# EAGLE design working (EAGLE 9.6.2)
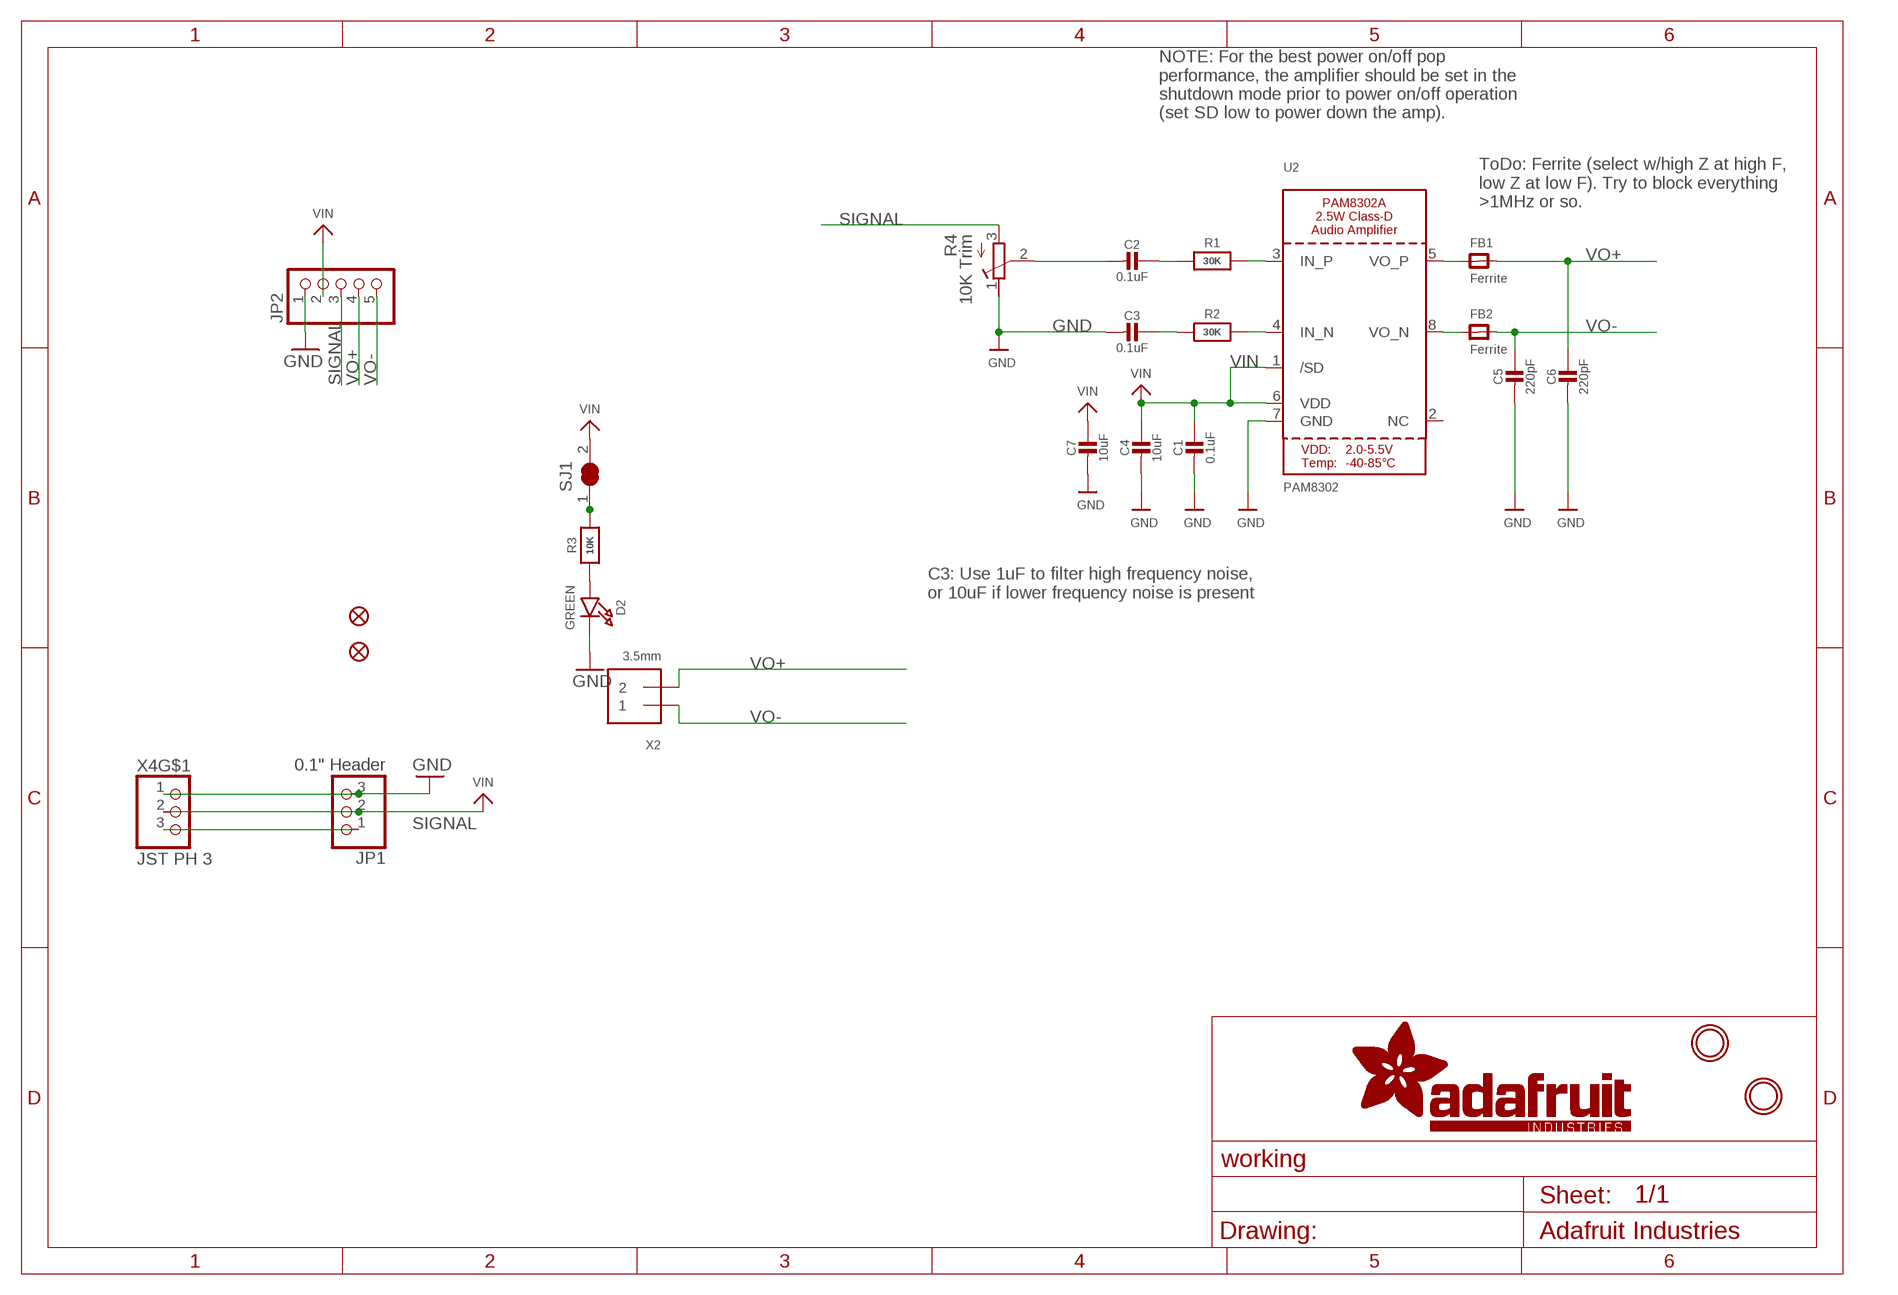
[diagram p0: schematic, sheet 1]

## Parts
C1  0.1uF  CAP_CERAMIC0603_NO  [0603-NO]
C2  0.1uF  CAP_CERAMIC0603_NO  [0603-NO]
C3  0.1uF  CAP_CERAMIC0603_NO  [0603-NO]
C4  10uF  CAP_CERAMIC0805-NOOUTLINE  [0805-NO]
C5  220pF  CAP_CERAMIC0603_NO  [0603-NO]
C6  220pF  CAP_CERAMIC0603_NO  [0603-NO]
C7  10uF  CAP_CERAMIC0805-NOOUTLINE  [0805-NO]
D2  GREEN  LED0603_NOOUTLINE  [CHIPLED_0603_NOOUTLINE]
FB1  Ferrite  FERRITE-0603NO  [0603-NO]
FB2  Ferrite  FERRITE-0603NO  [0603-NO]
FID2  FIDUCIAL_1MM  [FIDUCIAL_1MM]
FID3  FIDUCIAL_1MM  [FIDUCIAL_1MM]
JP1  0.1" Header  HEADER-1X3  [1X03_OVAL]
JP2  HEADER-1X570MIL  [1X05_ROUND_70]
R1  30K  RESISTOR_0603_NOOUT  [0603-NO]
R2  30K  RESISTOR_0603_NOOUT  [0603-NO]
R3  10K  RESISTOR_0603_NOOUT  [0603-NO]
R4  10K Trim  R-TRIMM3314J  [RTRIM3314J]
SJ1  SOLDERJUMPER_CLOSED  [SOLDERJUMPER_CLOSEDWIRE]
U2  PAM8302  AUDIOAMP_PAM8302A  [MSOP8_0.65MM]
U$1  MOUNTINGHOLE2.5  [MOUNTINGHOLE_2.5_PLATED]
U$8  MOUNTINGHOLE2.5  [MOUNTINGHOLE_2.5_PLATED]
X2  3.5mm  TERMBLOCK_1X2_3.5MM  [TERMBLOCK_1X2-3.5MM]
X4  JST PH 3  CON_JST_PH_3PIN  [JSTPH3]

## Nets
GND: C1.2 C3.2 C4.2 C5.2 C6.2 C7.2 D2.C JP1.3 JP2.1 R4.1(E) U2.7(GND) X4.1
IN+: R1.2 U2.3(IN_P)
IN-: R2.2 U2.4(IN_N)
N$1: R3.2 SJ1.1
N$5: C3.1 R2.1
N$8: C2.1 R1.1
N$9: C2.2 R4.2(S)
N$26: D2.A R3.1
OUT+: FB1.1 U2.5(VO_P)
OUT-: FB2.1 U2.8(VO_N)
SIGNAL: JP1.1 JP2.3 R4.3(A) X4.3
VIN: C1.1 C4.1 C7.1 JP1.2 JP2.2 SJ1.2 U2.1(/SD) U2.6(VDD) X4.2
VO+: C6.1 FB1.2 JP2.4 X2.2
VO-: C5.1 FB2.2 JP2.5 X2.1
Unconnected: U2.2(NC) X4.NC1(MT) X4.NC2(MT)

## Notes on the sheet
- NOTE: For the best power on/off pop
  performance, the amplifier should be set in the
  shutdown mode prior to power on/off operation
  (set SD low to power down the amp).
- ToDo: Ferrite (select w/high Z at high F,
  low Z at low F). Try to block everything
  >1MHz or so.
- C3: Use 1uF to filter high frequency noise,
  or 10uF if lower frequency noise is present

## Library data of the parts
C1-C7 = microbuilder:CAP_CERAMIC: Ceramic Capacitors For new designs, use the packages preceded by an '_' character since they are more reliable: The following footprints should be used on most boards: _0402 - Standard footprint for regular board layouts _0603 - Standard footprint for regular board layouts _0805 - Standard footprint for regular board layouts _1206 - Standard footprint for regular board layouts For extremely tight-pitch boards where space is at a premium, the following 'micro-pitch' footprints can be used (smaller pads, no silkscreen outline, etc.): _0402MP - Micro-pitch footprint for very dense/compact boards _0603MP - Micro-pitch footprint for very dense/compact boards _0805MP - Micro-pitch footprint for very dense/compact boards _1206MP - Micro-pitch footprint for very dense/compact boards
D2 = microbuilder:LED: LED 0603 - 0603 Surface Mount Package 2mA: Green LED - Low Power (3.9mcd, 2ma, 1.7Vf) - Digikey: 475-2709-2-ND Orange LED - Low Power (9.8mcd, 2ma, 1.8Vf) - Digikey: 475-1194-2-ND Red LED - Low Power (5mcd, 2ma, 1.8Vf) - Digikey: 475-1195-2-ND Yellow LED - Low Power (7mcd, 2ma, 1.8Vf) - Digikey: 475-1196-2-ND 5mA: Blue LED - Low Power (17mcd, 5ma, 2.9Vf) - Digikey: LNJ937W8CRACT-ND 0805 - 0805 Surface Mount Package 2mA: Red LED (8.8mcd, 2mA, 1.8Vf, Clear) - Low Power [Digikey: 475-2510-1-ND] Green LED (5mcd, 2mA, 1.8Vf, Clear) - Low Power [Digikey: 475-2730-1-ND] Yellow LED (11.3mcd, 2mA, 1.8Vf, Clear) - Low Power [Digikey: 475-2555-1-ND] 20mA: Red LED (104mcd, 20mA, Diffused) - LS R976 [Digikey: 475-1278-6-ND] Red LED (12mcd, 20mA, 2.0Vf, Clear) - APT2012EC [Digikey: 754-1128-1-ND] Green LED (15mcd, 20mA, 2.2Vf, Clear) - APT2012GC [Digikey: 754-1131-1-ND] Orange LED (160mcd, 20mA, 2.1Vf, Clear) - APT2012SECK [Digikey: 754-1130-1-ND] 1206 - 1206 Surface Mount Package Green LED (26mcd, 20mA, Diffused) - LG N971 [Digikey: 475-1407-6-ND] Red LED (15mcd, 20mA, Diffused) - LH N974 [Digikey: 475-1416-6-ND] Cree - Cree High-Power Surface Mount LEDs XPEBWT-L1-0000-00D50 - White 111lm 350mA 2.9Vf 6200K 110° XTEAWT-00-0000-00000LEE3 - White 114lm 350mA 2.85Vf 5000K 115° Everlight - Everlight 45-21 Series Surface Mount LEDs 45-21/QK2C-B2832AC2CB2/2T - Warm White 2000mcd 20mA 3.25Vf 3050K 120° 45-21/LK2C-B38452C4CB2/2T - Nuetral White 2000mcd 20mA 3.25Vf 4150K 120° 45-21/LK2C-B50634C6CB2/2T - Cold White 2200mcd 20mA 3.25Vf 5650K 120° PLCC2 Reverse Mount LS T77K-J1L2-1-0-2-R18-Z - Red 11.25mcd 2mA 1.8Vf 630nm 120° LO T77K-L1M2-24-Z - Orange 19.6mcd 2mA 1.8Vf 606nm 120° LY T77K-K2M1-26-Z - Yellow 15.7mcd 2mA 1.8Vf 587nm 120°; ROT: 270
FB1 FB2 = microbuilder:FERRITE: Ferrite Bead 0603 MMZ1608B121C - 120 Ohm @ 100MHz, 600mA, 0.15 Ohm DC Resistance - Digikey: 445-2164-1-ND BK1608HW121-T - 120 Ohm, 600mA Ferrite Chip - Digikey: 587-1876-2-ND 0805 HZ0805B272R-10 - 2.7K Ohm @ 100MHz, 200mA, 0.8 Ohm DC Resistance - Digikey: 240-2504-1-ND (see also Murata BLM21BD272SN1L) MMZ2012Y152B - 1.5K Ohm @ 100MHz, 500mA, 0.4 Ohm DC Resistance - Digikey: 445-1560-1-ND - Mainly for high frequency (80-400MHz) MMZ2012R102A - 1K Ohm @ 100MHz, 500mA, 0.3 Ohm DC Resistance - Digikey: 445-1555-2-ND - More general purpose (10-200MHz)
FID2 FID3 = microbuilder:FIDUCIAL: Fiducial Alignment Points Various fiducial points for machine vision alignment.; BOM: EXCLUDE
JP1 = microbuilder:HEADER-1X3: PIN HEADER
JP2 = microbuilder:HEADER-1X5: PIN HEADER
R1-R3 = microbuilder:RESISTOR: Resistors For new designs, use the packages preceded by an '_' character since they are more reliable: The following footprints should be used on most boards: _0402 - Standard footprint for regular board layouts _0603 - Standard footprint for regular board layouts _0805 - Standard footprint for regular board layouts _1206 - Standard footprint for regular board layouts For extremely tight-pitch boards where space is at a premium, the following 'micro-pitch' footprints can be used (smaller pads, no silkscreen outline, etc.): _0402MP - Micro-pitch footprint for very dense/compact boards _0603MP - Micro-pitch footprint for very dense/compact boards _0805MP - Micro-pitch footprint for very dense/compact boards _1206MP - Micro-pitch footprint for very dense/compact boards
R4 = adafruit_electromech:R-TRIMM: Trimm resistor; SPICEMODEL: X; SPICEPREFIXL: POT
SJ1 = microbuilder:SOLDERJUMPER_CLOSED: Solder Jumper - Closed These solder jumpers are closed by default CLOSEDWIRE - 10 mil trace between pads that can be cut and resoldered later CLOSEDPERM - 63 mil trace between pads for a permanent connection (used to 'bridge' two signals, a shameless hack for Eagle). Can double as a test point as well (no cream layer)
U2 = microbuilder:AUDIOAMP_PAM8302A: PAM8302A - 2.5W Class-D Mono Audio Amplifier MSOP8 = PAM8302AASCR
U$1 U$8 = adafruit_electromech:MOUNTINGHOLE: Mounting Hole For #2 screws (0.086"/2.18mm width, 0.094"/2.4mm hole) use 2.5mm; BOM: EXCLUDE
X2 = adafruit_electromech:TERMBLOCK_1X2: 3.5mm Terminal block http://www.ladyada.net/library/pcb/eaglelibrary.html; ROT: 180
X4 = adafruit_electromech:CON_JST_PH_3PIN

## Net classes
1 HV: width 0.406 mm, drill 0.381 mm, clearance 0.762 mm

## Board
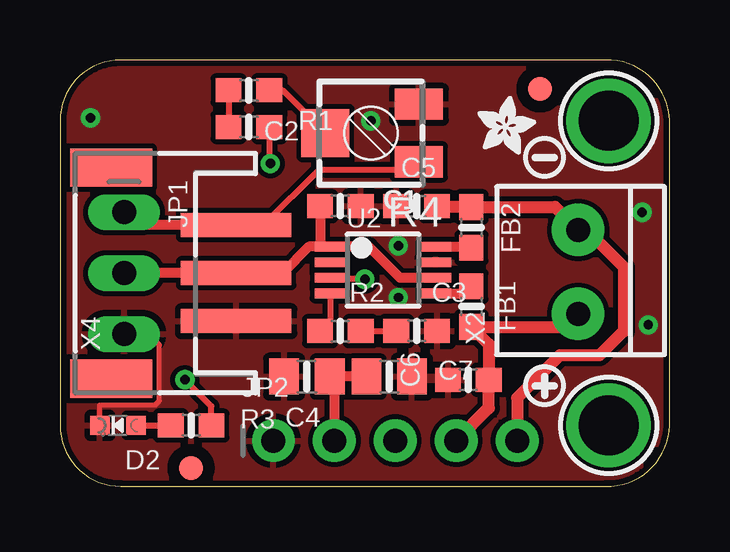
[diagram p1: board, top side]
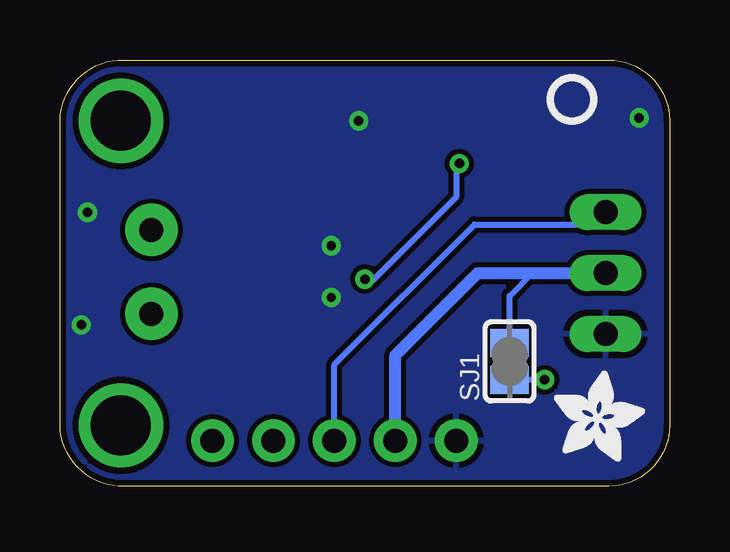
[diagram p2: board, bottom side, seen from below]

Size 25.4 x 17.78 mm. Coordinates in mm from the lower left corner, seen from the top.
Outline: 0,15.24 0,2.54 arc90 2.54,0 22.73,0 arc90 25.4,2.54 25.4,15.24 arc90 22.73,17.78 2.54,17.78 arc90 0,15.24
Copper layers (1*16): Top 0.035mm / dielectric 1.5mm / Bottom 0.035mm
Design rules "adafruit": minimum track width 8mil, minimum drill 15.5mil, track to track 8mil, track to pad 8mil, pad to pad 8mil, via to via 8mil, smd to smd 8mil, copper to edge 10mil, drill to drill 8mil, minimum pad ring 10mil, minimum via ring 8mil, stop-mask expansion 2mil, vias tented up to drill 20mil, thermal gap 10mil

### Footprints (pad centres in the part's own frame; a part is rotated, then mirrored left to right if it is on the bottom)
0603-NO = smd 1.075 x 1: 1 -0.85,0; 2 0.85,0
0805-NO = smd 1.24 x 1.5: 1 -0.95,0; 2 0.95,0
CHIPLED_0603_NOOUTLINE = smd 0.8 x 0.8: A 0,-0.75; C 0,0.75
FIDUCIAL_1MM = smd 1 x 1: 1 0,0
1X03_OVAL = drill 1 long: 1 -2.54,0; 2 0,0; 3 2.54,0
1X05_ROUND_70 = drill 1 pad 1.778: 1 -5.08,0; 2 -2.54,0; 3 0,0; 4 2.54,0; 5 5.08,0
RTRIM3314J = smd 1.3 x 2: 1 1.2,-2; 3 -1.2,-2 | smd 2 x 2: 2 0,1.9
SOLDERJUMPER_CLOSEDWIRE = smd 1.168 x 1.6: 1 -0.762,0; 2 0.762,0 | smd 0.635 x 0.203: WIRE 0,0
MSOP8_0.65MM = smd 0.4 x 1.3: 1 -0.975,-2.2; 2 -0.325,-2.2; 3 0.325,-2.2; 4 0.975,-2.2; 5 0.975,2.2; 6 0.325,2.2; 7 -0.325,2.2; 8 -0.975,2.2
MOUNTINGHOLE_2.5_PLATED = drill 2.5 pad 3.2: P$1 0,0
TERMBLOCK_1X2-3.5MM = drill 1 pad 2.184: 1 1.8,0; 2 -1.7,0
JSTPH3 = smd 1 x 4.6: 1 -2,-2.7; 2 0,-2.7; 3 2,-2.7 | smd 1.6 x 3.4: NC1 -4.4,2.5; NC2 4.4,2.5

### Placement (x,y rotation side)
C1  11.68,11.68 0 top
C2  7.87,16.51 0 top
C3  14.86,6.48 0 top
C4  10.29,4.57 180 top
C5  14.86,11.68 180 top
C6  17.02,4.45 180 top
C7  13.72,4.57 0 top
D2  2.41,2.54 90 top
FB1  17.14,7.49 270 top
FB2  17.14,10.79 90 top
FID2  5.46,0.76 0 top
FID3  20,16.57 0 top
JP1  2.67,8.89 270 top
JP2  13.97,1.91 0 top
PLABEL0  [PLABEL0]  1.4,0.76 0 top
PLABEL1  [PLABEL1]  16.64,12.45 90 top
PLABEL2  [PLABEL2]  2.03,15.88 0 top
PLABEL3  [PLABEL3]  12.83,15.88 0 bottom
PLABEL4  [PLABEL4]  11.68,13.46 0 bottom
PLABEL5  [PLABEL5]  12.32,10.41 0 bottom
PLABEL6  [PLABEL6]  23.62,8.89 90 bottom
PLABEL7  [PLABEL7]  8.89,3.05 90 bottom
PLABEL8  [PLABEL8]  11.43,3.05 90 bottom
PLABEL9  [PLABEL9]  13.97,3.05 90 bottom
PLABEL10  [PLABEL10]  16.51,3.05 90 bottom
PLABEL11  [PLABEL11]  19.05,3.05 90 bottom
PLABEL12  [PLABEL12]  8,7.62 0 bottom
R1  7.87,14.99 0 top
R2  11.68,6.48 180 top
R3  5.46,2.54 0 top
R4  12.95,14.73 90 top
SJ1  6.67,5.21 90 bottom
U2  13.46,9.02 270 top
U$1  22.86,2.54 0 top
U$3  [SYMBOL_PLUS]  20.19,4.19 0 top
U$5  [PCBFEAT-REV-040]  4.06,16.13 180 bottom
U$8  22.86,15.24 0 top
U$9  [SYMBOL_MINUS]  20.19,13.72 0 top
U$12  [ADAFRUIT_3.5MM]  4.83,1.02 0 bottom
U$19  [ADAFRUIT_2.5MM]  17.4,13.84 0 top
X2  21.59,8.89 90 top
X4  4.64,8.89 90 top

### Tracks (layer width: path | path; a pad name or v marks a point on that pad's centre or on a via)
GND  (via drill 0.39)
  Top 0.203: D2.C 1.66,3.37 1.65,3.38 3.96,3.38 4.14,3.56 4.14,5.88 4.15,5.88 3.68,6.35 JP1.3
  other vias: 14.1,7.87 14.1,10.03 1.27,15.37 12.95,15.24 24.26,11.43 24.51,6.73
  pour Top: 0,17.78 25.4,17.78 25.4,0 0,0
  pour Bottom: 0,17.78 25.4,17.78 25.4,0 0,0
IN+  (via drill 0.39)
  Top 0.254: R1.2 8.72,13.5 v8.76,13.46 | v12.7,8.64 11.32,8.64 U2.3
  Bottom 0.254: v8.76,13.46 8.89,13.34 8.89,12.06 12.45,8.51 12.57,8.51 v12.7,8.64
IN-
  Top 0.254: U2.4 11.26,6.91 R2.2
N$1  (via drill 0.39)
  Top 0.254: R3.2 6.31,3.34 v5.21,4.45
  Bottom 0.254: v5.21,4.45 SJ1.1
N$5
  Top 0.254: R2.1 C3.1
N$8
  Top 0.254: C2.1 R1.1
N$9
  Top 0.254: R4.2 9.28,16.51 C2.2
N$26
  Top 0.254: D2.A R3.1
OUT+
  Top 0.406: U2.5 16.84,8.04
  Top 0.508: 16.84,8.04 FB1.1
OUT-
  Top 0.406: U2.8 17.1,9.99
  Top 0.508: 17.1,9.99 FB2.1
SIGNAL
  Top 0.254: X4.3 8.48,10.89 10.8,13.21 14.63,13.21 R4.3
  Top 0.406: X4.3 3.21,10.89 JP1.1
  Bottom 0.254: JP2.3 13.97,5.08 8.13,10.92 3.17,10.92 JP1.1
VIN
  Top 0.406: JP2.2 11.43,4.38 C4.1 C7.1 | 10.92,9.99 U2.1 12.87,9.99 14.17,8.69 U2.6 | 10.92,9.99 10.37,9.99 9.27,8.89 X4.2 JP1.2 | C1.1 10.83,10.08 10.92,9.99
  Bottom 0.254: SJ1.2 6.67,7.94 5.71,8.89 JP1.2
  Bottom 0.508: JP2.2 11.43,5.46 8,8.89 JP1.2
VO+
  Top 0.508: X2.2 21.04,6.64 FB1.2 17.87,5.92 C6.1 17.87,3.26 JP2.4
VO-
  Top 0.508: C5.1 15.75,11.64 FB2.2 20.64,11.64 X2.1 21.95,10.69 23.5,9.14 23.5,6.48 22.48,5.46 20.83,5.46 19.05,3.68 JP2.5

### Text on the board
Pinguin_tBackup: PAM / 8302 | ON | Motor/ / MOSFET / Driver | Volume | Sig
Pinguin_bBackup: PAM8302 | Adafruit STEMMA / MOSFET+Diode Driver | Mono 3W Class D Amp | In | On | Vin: 3-5VDC / Max gain 14dB/5x | V+ | 4-8Ω Load | LED, Motor, Solenoid / Out+Vin, Out- Switched / 1.5A Cont. Current / Power:3~30VDC / Logic/PWM:3~20VDC | LED | Sig | GND | GND | Out | GND | V+ | VIN | SIGNAL | In | VO+ | VO-